# EAGLE design RobotFish (EAGLE 6.5.0)
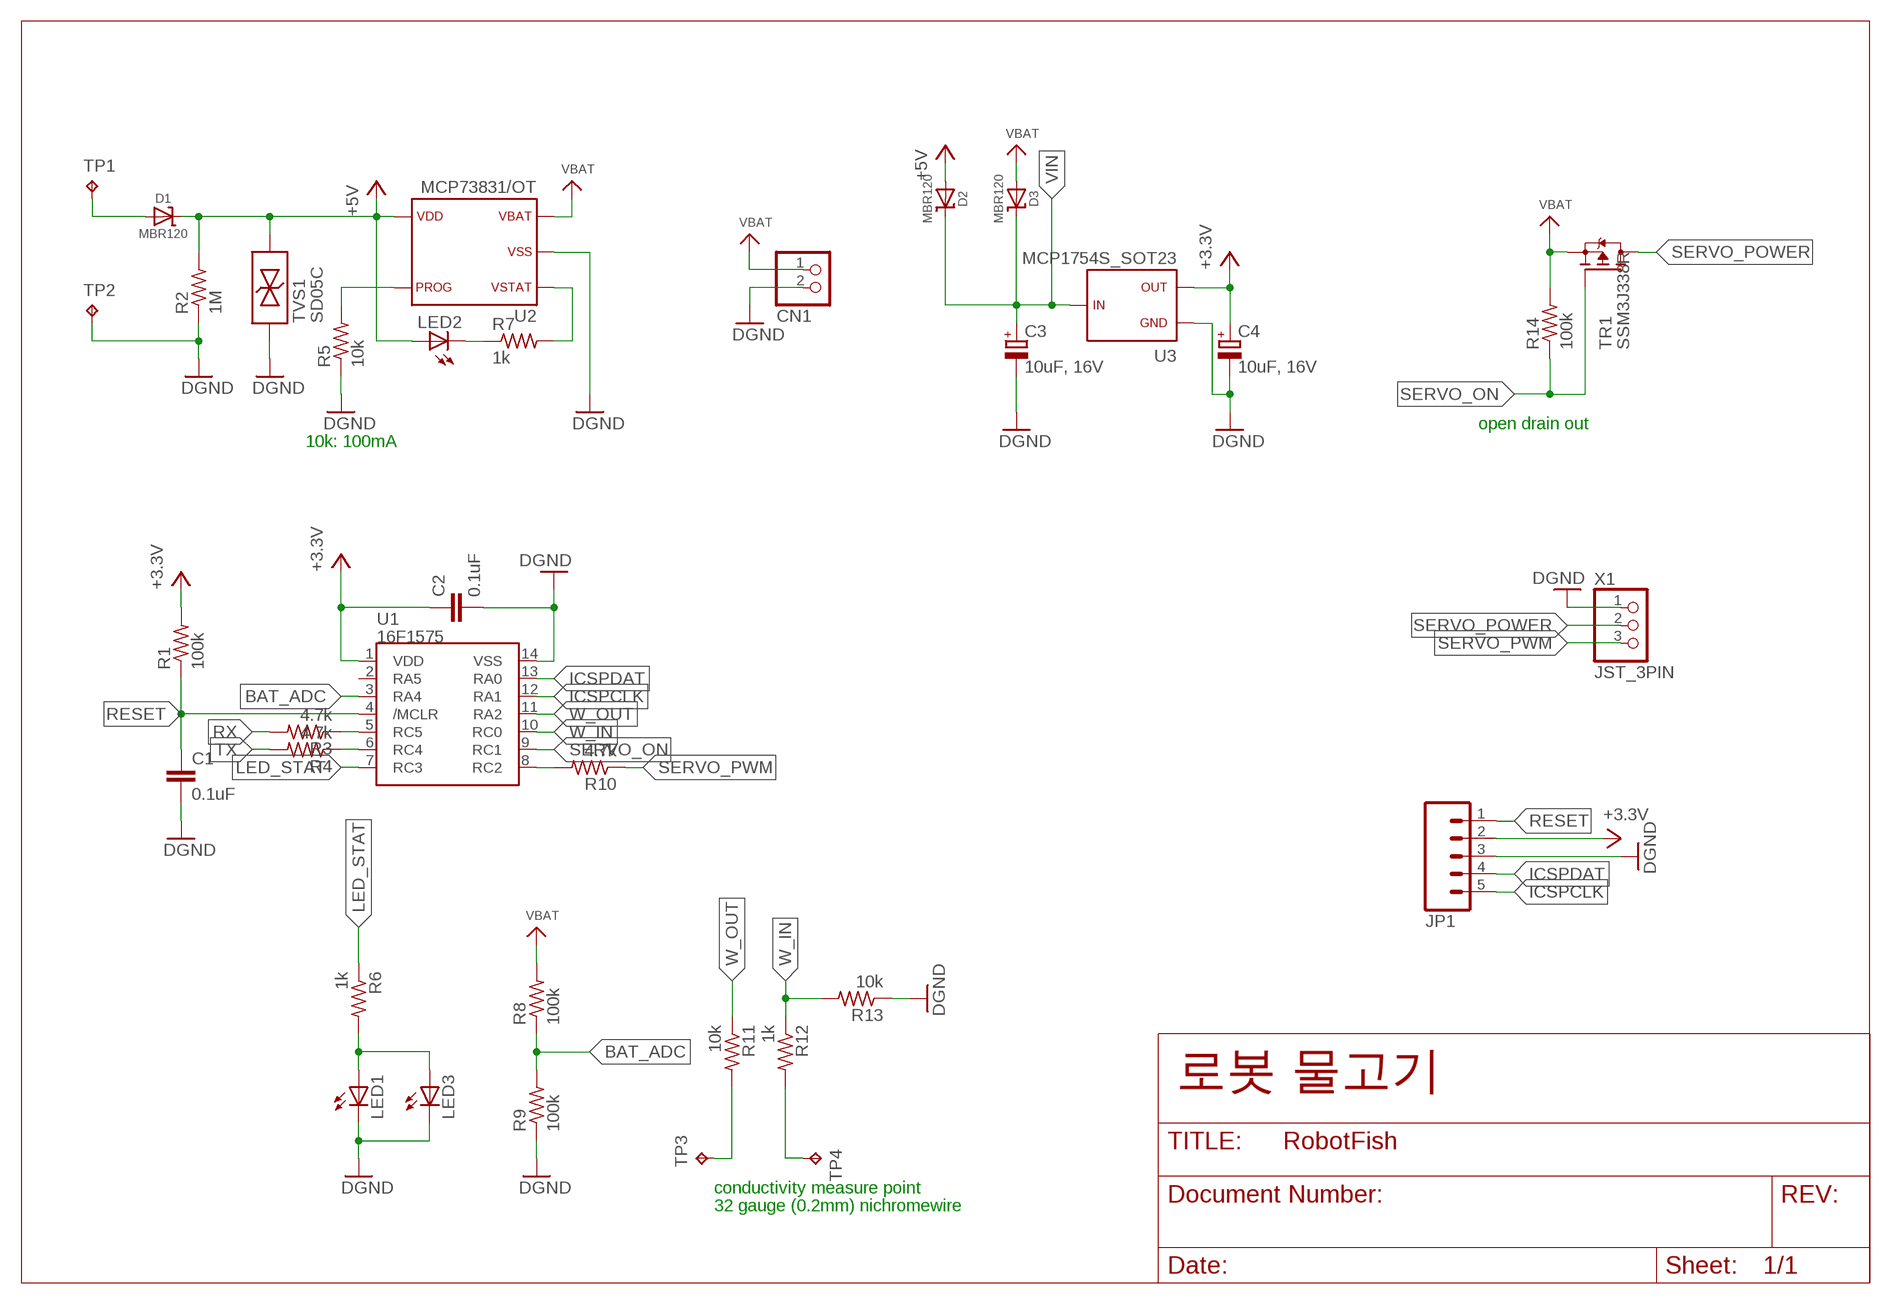
[diagram p0: schematic, sheet 1]

## Parts
C1  0.1uF  C0603(1608)  [C0603(1608)]
C2  0.1uF  C0603(1608)  [C0603(1608)]
C3  10uF, 16V  C-TANTAL-A  [C1206(3216)-A]
C4  10uF, 16V  C-TANTAL-A  [C1206(3216)-A]
CN1  JST_2PIN-THM-RA  [JST-PH-2-THM-RA]
D1  MBR120  DIODE-SCHOTTKYSOD-123  [SOD-123]
D2  MBR120  DIODE-SCHOTTKYSOD-123  [SOD-123]
D3  MBR120  DIODE-SCHOTTKYSOD-123  [SOD-123]
JP1  M05PTH  [1X05]
LED1  LED0603  [LED-0603]
LED2  LED0603  [LED-0603]
LED3  LED3MM  [LED3MM]
R1  100k  R0603(1608)  [R0603(1608)]
R2  1M  R0603(1608)  [R0603(1608)]
R3  4.7k  R0603(1608)  [R0603(1608)]
R4  4.7k  R0603(1608)  [R0603(1608)]
R5  10k  R0603(1608)  [R0603(1608)]
R6  1k  R0603(1608)  [R0603(1608)]
R7  1k  R0603(1608)  [R0603(1608)]
R8  100k  R0603(1608)  [R0603(1608)]
R9  100k  R0603(1608)  [R0603(1608)]
R10  4.7k  R0603(1608)  [R0603(1608)]
R11  10k  R0603(1608)  [R0603(1608)]
R12  1k  R0603(1608)  [R0603(1608)]
R13  10k  R0603(1608)  [R0603(1608)]
R14  100k  R0603(1608)  [R0603(1608)]
TP1  TP-5010  [TP-5010]
TP2  TP-5010  [TP-5010]
TP3  TP-5010  [TP-5010]
TP4  TP-5010  [TP-5010]
TR1  SSM3J338R  [SOT23]
TVS1  SD05C  SD0  [SOD-323-NOPOL]
U1  16F1575  [SO-14]
U2  MCP73831/OT  [SOT23-5L]
U3  MCP1754S_SOT23  [SOT23]
X1  JST_3PIN  [SM03B-SRSS-TB]

## Nets
+3.3V: C2.1 C4.1(+) JP1.2 R1.2 U1.1(VDD) U3.2
+5V: D1.C D2.A LED2.A R2.2 TVS1.2 U2.4(VDD)
BAT_ADC: R8.1 R9.2 U1.3(RA4)
DGND: C1.2 C2.2 C3.2(-) C4.2(-) CN1.2 JP1.3 LED1.C LED3.K(C) R2.1 R5.1 R9.1 R13.1 TP2.TP TVS1.1 U1.14(VSS) U2.2(VSS) U3.1 X1.1
ICSPCLK: JP1.5 U1.12(RA1)
ICSPDAT: JP1.4 U1.13(RA0)
LED_STAT: R6.1 U1.7(RC3)
N$1: R5.2 U2.5(PROG)
N$2: R7.2 U2.1(STAT)
N$3: LED2.C R7.1
N$4: R10.2 U1.8(RC2)
N$5: D1.A TP1.TP
N$6: R3.1 U1.5(RC5)
N$7: R4.1 U1.6(RC4)
N$8: LED1.A LED3.A R6.2
N$15: R11.2 TP3.TP
N$16: R12.2 TP4.TP
RESET: C1.1 JP1.1 R1.1 U1.4(/MCLR)
RX: R3.2
SERVO_ON: R14.1 TR1.1(G) U1.9(RC1)
SERVO_POWER: TR1.3(D) X1.2
SERVO_PWM: R10.1 X1.3
TX: R4.2
VBAT: CN1.1 D3.A R8.2 R14.2 TR1.2(S) U2.3(VBAT)
VIN: C3.1(+) D2.C D3.C U3.3
W_IN: R12.1 R13.2 U1.10(RC0)
W_OUT: R11.1 U1.11(RA2)
Unconnected: U1.2(RA5)

## Notes on the sheet
- open drain out
- 10k: 100mA
- 로봇 물고기
- conductivity measure point
- 32 gauge (0.2mm) nichromewire

## Library data of the parts
C1 C2 = water:C
C3 C4 = berry:C-TANTAL-A: TAJA105M020RNJ Tantal Capacitor Manufacturer: AVX 1206(3126) Ref: www.avx.com/docs/techinfo/tantappl.pdf
CN1 = water:JST_2PIN: JST 2-Pin Connectors of various flavors SMT-RA (S2B-PH-SM4) 4UConnector #17311 SMT (B2B-PH-SM4) THM-RA (S2B-PH) THM (B2B-PH)
D1-D3 = microbuilder:DIODE-SCHOTTKY
JP1 = SparkFun-Connectors:M05: Header 5 Standard 5-pin 0.1" header. Use with straight break away headers (SKU : PRT-00116), right angle break away headers (PRT-00553), swiss pins (PRT-00743), machine pins (PRT-00117), and female headers (PRT-00115). Molex polarized connector foot print use with SKU : PRT-08230 with associated crimp pins and housings.
LED1-LED3 = berry:LED: LEDs Standard schematic elements and footprints for 5mm, 3mm, 1206, and 0603 sized LEDs. 5mm - Spark Fun Electronics SKU : COM-00529 (and others)
R1-R14 = water:R
TP1-TP4 = water:TP
TR1 = water:SSM3J338R
TVS1 = berry:SD0: semtech TVS diode SD05C - 5V version SD12C - 12V version
U1 = water:16F1575
U2 = water:MCP73831: MCP73831/2 Miniature Single-Cell, Fully Integrated Li-Ion, Li-Polymer Charge Management Controllers. Nice and small simple lipoly charge controller, with adjustable current and status output (LED) http://www.ladyada.net/library/pcb/eaglelibrary.html
U3 = berry:MCP1754S: MCP1754s high PSRR LDO from Microchips
X1 = water:JST_3PIN

## Board
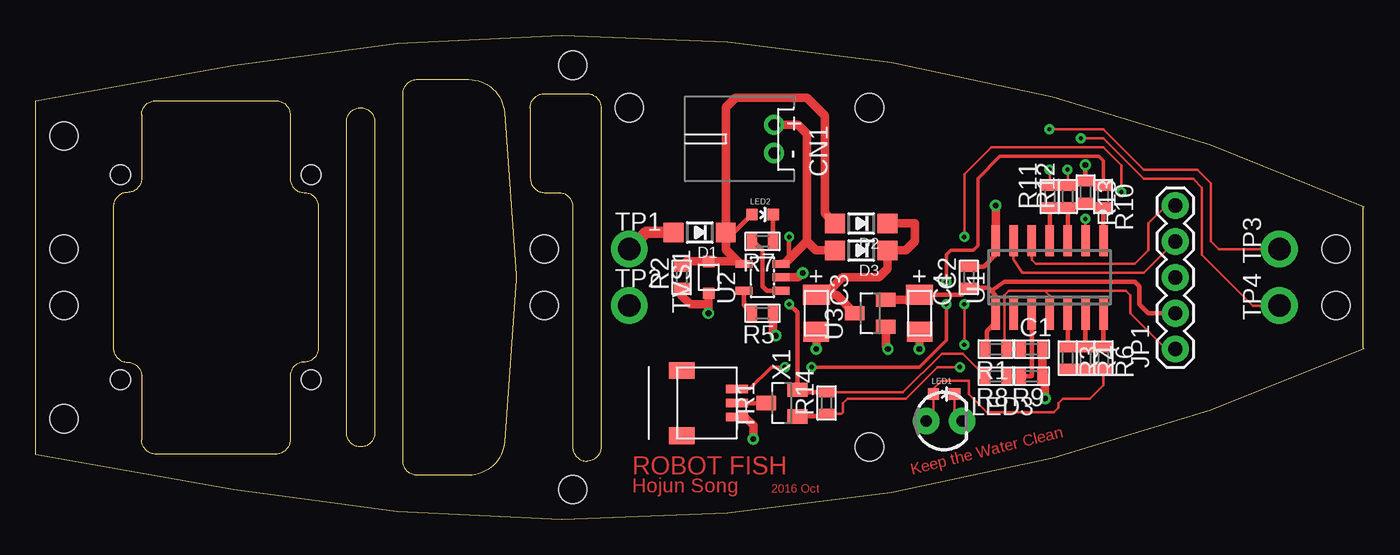
[diagram p1: board, top side]
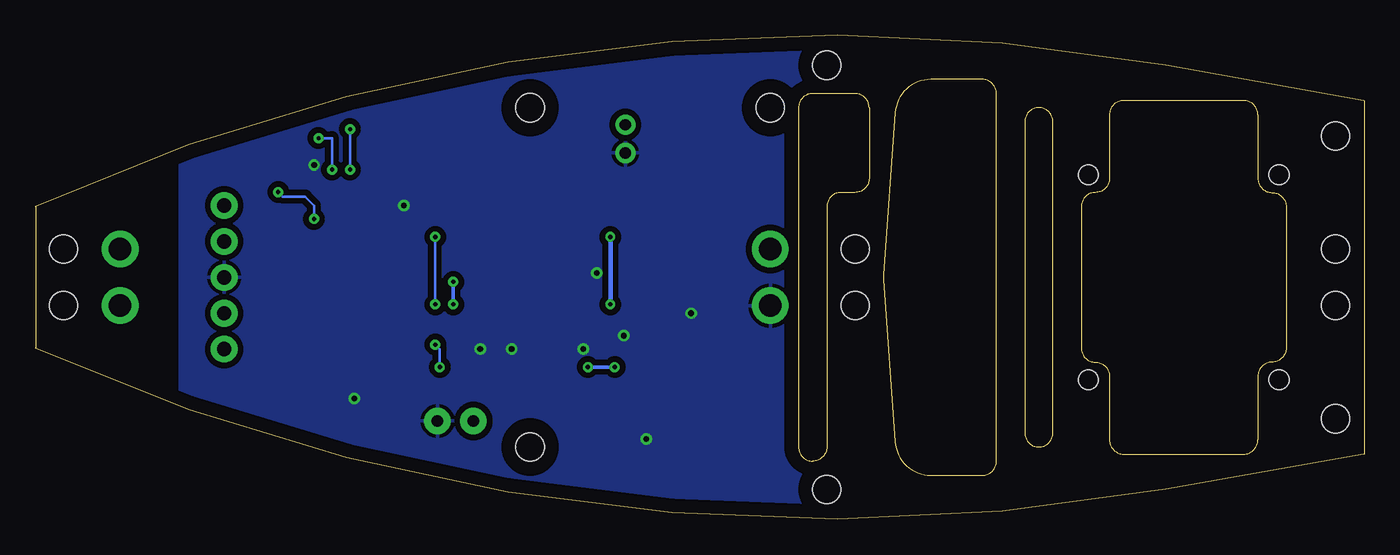
[diagram p2: board, bottom side, seen from below]

Size 94.02 x 34.23 mm. Coordinates in mm from the lower left corner, seen from the top.
Outline: 93.96,12.12 93.96,22.12
Outline: 0,29.62 0,4.62
Outline: 0.02,29.62 14.02,32.12 arc-34 94.02,22.12
Outline: 0.02,4.62 14.02,2.12 arc34 94.02,12.12
Outline: 38.02,22.12 38.02,5.12 arc90 39.02,4.12 arc90 40.02,5.12 40.02,29.12 arc90 39.02,30.12 36.02,30.12 arc90 35.02,29.12 35.02,24.12 arc90 36.02,23.12 37.02,23.12 arc-90 38.02,22.12
Outline: 7.52,28.62 7.52,24.12 arc-90 6.52,23.12 arc90 5.52,22.12 5.52,12.12 arc90 6.52,11.12 arc-90 7.52,10.12 7.52,5.62 arc90 8.52,4.62 17.02,4.62 arc90 18.02,5.62 18.02,10.12 arc-90 19.02,11.12 arc90 20.02,12.12 20.02,22.12 arc90 19.02,23.12 arc-90 18.02,24.12 18.02,28.62 arc90 17.02,29.62 8.52,29.62 arc90 7.52,28.62
Outline: 33.19,28.76 34.01,17.3 arc-8 34.01,16.93 33.19,5.47 arc-86 30.66,3.12 27.02,3.12 arc-90 26.02,4.12 26.02,30.12 arc-90 27.02,31.12 30.66,31.12 arc-86 33.19,28.76
Outline: 23.02,5.12 arc-90 22.02,6.12 22.02,28.12 arc-90 23.02,29.12 arc-90 24.02,28.12 24.02,6.12 arc-90 23.02,5.12
Copper layers (1*16): Top 0.035mm / dielectric 1.5mm / Bottom 0.035mm
Design rules "default": minimum track width 10mil, minimum drill 24mil, track to track 8mil, track to pad 8mil, pad to pad 8mil, via to via 8mil, smd to smd 8mil, copper to edge 40mil, drill to drill 8mil, minimum pad ring 10mil, minimum via ring 8mil, stop-mask expansion 4mil, vias tented up to drill 0mil, thermal gap 10mil
Holes 1.4 mm at 6.02,24.37 19.52,24.37 6.02,9.87 19.52,9.87
Holes 2 mm at 2.02,19.12 2.02,15.12 92.02,19.12 92.02,15.12 38.02,32.12 38.02,2.12 2.02,27.12 2.02,7.12 59.02,29.12 59.02,5.12 36.02,19.12 36.02,15.12 42.02,29.12

### Footprints (pad centres in the part's own frame; a part is rotated, then mirrored left to right if it is on the bottom)
C0603(1608) = smd 0.7 x 1.1: 1 -0.75,0; 2 0.75,0
C1206(3216)-A = smd 1.4 x 1.9: 1 -1.3,0 | smd 1.4 x 1.8: 2 1.3,0
JST-PH-2-THM-RA = drill 0.8 pad 1.422: 1 1,0; 2 -1,0
SOD-123 = smd 1.4 x 1.4: A 1.85,0; C -1.85,0
1X05 = drill 1.016 pad 1.88: 1 0,0; 2 2.54,0; 3 5.08,0; 4 7.62,0; 5 10.16,0
LED-0603 = smd 0.8 x 0.8: A 0,-0.75; C 0,0.75
LED3MM = drill 0.813 pad 1.88: A -1.27,0; K 1.27,0
R0603(1608) = smd 0.7 x 1.1: 1 -0.75,0; 2 0.75,0
TP-5010 = drill 1.6 pad 2.6: TP 0,0
SOT23 = smd 1 x 1.4: 1 -0.95,-1.1; 2 0.95,-1.1; 3 0,1.1
SOD-323-NOPOL = smd 0.8 x 0.8: 1 -1.125,0; 2 1.125,0
SO-14 = smd 0.6 x 2.2: 1 -3.81,-2.6; 2 -2.54,-2.6; 3 -1.27,-2.6; 4 0,-2.6; 5 1.27,-2.6; 6 2.54,-2.6; 7 3.81,-2.6; 8 3.81,2.6; 9 2.54,2.6; 10 1.27,2.6; 11 0,2.6; 12 -1.27,2.6; 13 -2.54,2.6; 14 -3.81,2.6
SOT23-5L = smd 0.55 x 1.2: 1 -0.95,-1.3; 2 0,-1.3; 3 0.95,-1.3; 4 0.95,1.3; 5 -0.95,1.3
SM03B-SRSS-TB = smd 0.6 x 1.55: 1 1,0; 2 0,0; 3 -1,0 | smd 1.2 x 1.8: P$1 2.3,-3.895; P$2 -2.3,-3.895

### Placement (x,y rotation side)
C1  70.5,12.04 0 top
C2  66.06,17.12 90 top
C3  55.26,14.58 270 top
C4  62.56,14.58 270 top
CN1  52.28,26.91 90 top
D1  47.01,20.29 180 top
D2  58.44,20.93 180 top
D3  58.44,19.02 180 top
JP1  80.66,12.04 90 top
LED1  64.29,8.86 270 top
LED2  51.45,21.56 270 top
LED3  64.29,6.96 0 top
R1  67.96,12.04 180 top
R2  45.73,17.12 90 top
R3  73.04,11.4 270 top
R4  74.31,11.4 270 top
R5  51.45,14.58 180 top
R6  75.58,11.4 270 top
R7  51.45,19.66 180 top
R8  67.96,10.13 180 top
R9  70.5,10.13 180 top
R10  75.55,22.83 270 top
R11  71.77,22.83 90 top
R12  73.04,22.83 90 top
R13  74.31,23.15 270 top
R14  55.99,8.23 90 top
TP1  42.02,19.12 0 top
TP2  42.02,15.12 0 top
TP3  88.02,19.12 90 top
TP4  88.02,15.12 90 top
TR1  52.82,8.23 90 top
TVS1  47.64,17.12 90 top
U1  71.77,17.12 0 top
U2  51.45,17.12 90 top
U3  59.07,14.58 90 top
X1  49.64,8.23 270 top

### Tracks (layer width: path | path; a pad name or v marks a point on that pad's centre or on a via)
+3.3V
  Top 0.305: 67.63,16.16 67.43,16.37 C2.1 65.56,15.88 C4.1 | 67.63,16.16 67.94,15.85 67.94,14.53 U1.1 67.96,13.96 67.31,13.31 67.31,12.14 R1.2 | JP1.2 78.74,14.58 78.11,15.21 78.11,16.48 77.79,16.8 68.58,16.8 67.63,16.16
  Top 0.61: U3.2 62.53,15.53 C4.1
+5V
  Top 0.305: D1.C 49.43,20.29 LED2.A
  Top 0.61: D2.A 55.88,21.63 55.88,28.55 54.61,29.82 49.53,29.82 48.86,29.14 D1.C 48.86,19.06 49.53,18.39 | 49.53,18.39 49.85,18.07 U2.4 | 49.53,18.39 49.39,18.24 TVS1.2 46.11,18.24 R2.2
BAT_ADC
  Top 0.305: U1.3 70.5,10.15 70.49,10.13 R9.2 R8.1
DGND  (via drill 0.4)
  Top 0.16: LED1.C 65.04,7.48 LED3.K
  Top 0.305: C2.2 67.11,17.87 67.94,18.7 67.94,19.7 U1.14 | R13.1 74.31,24.72 v74.3,25.05
  Top 0.61: U2.2 53.98,17.12 v54.29,17.43 | C3.2 55.26,12.37 v55.25,12.04 | U3.1 60.17,12.19 v60.33,12.04 | C4.2 62.56,12.05 v62.55,12.04 | TVS1.1 47.64,15.21 | 47.64,15.21 47.64,14.59 v47.62,14.58 | R2.1 45.73,15.83 46.36,15.21 47.64,15.21 | R5.1 52.2,13.18 v52.39,12.99 | U1.14 67.96,22.18 v67.94,22.2 | X1.1 50.21,7.23 50.8,6.64 v50.8,5.69 | C1.2 R9.1 71.44,10.13 v71.44,8.54
  pour Bottom (isolate 0.406): 0,29.82 30.48,34.9 66.04,33.63 83.82,26.01 83.82,8.23 67.31,0.61 30.48,-0.66 0,4.42
ICSPCLK
  Top 0.16: JP1.5 80.01,22.2 78.74,20.93 78.74,19.02 77.79,18.07 70.8,18.07 70.5,18.37 U1.12
ICSPDAT
  Top 0.16: JP1.4 80.65,19.66 78.42,17.43 69.85,17.43 69.22,18.39 69.22,19.7 U1.13
LED_STAT
  Top 0.305: R6.1 U1.7
N$1
  Top 0.305: U2.5 50.15,15.13 R5.2
N$2
  Top 0.305: R7.2 50.8,19.66 51.44,19.02 51.44,16.48 51.75,16.17 U2.1
N$3
  Top 0.305: LED2.C R7.1
N$4
  Top 0.305: U1.8 75.58,22.05 R10.2
N$5
  Top 0.813: D1.A 43.2,20.29 TP1.TP
N$6
  Top 0.305: U1.5 R3.1
N$7
  Top 0.305: U1.6 R4.1
N$8
  Top 0.16: LED3.A 63.54,7.16 LED1.A 63.54,9.22 64.14,9.81 66.04,9.81 66.04,8.86 67.31,7.59 72.07,7.59 72.39,7.91 72.39,8.23 72.71,8.54 74.61,8.54 75.56,9.5 75.56,10.64 R6.2
N$15  (via drill 0.3)
  Top 0.16: R11.2 71.77,24.72 v71.75,24.74 | TP3.TP 83.72,19.12 83.19,19.66 83.19,23.78 82.23,24.74 78.42,24.74 75.56,27.59 v71.75,27.59
  Bottom 0.16: v71.75,24.74 v71.75,27.59
N$16  (via drill 0.3)
  Top 0.16: R12.2 73.04,24.72 v73.03,24.74 | TP4.TP 86.14,15.12 82.55,18.7 82.55,23.47 81.92,24.1 78.42,24.1 75.56,26.96 v73.98,26.96
  Bottom 0.16: v73.03,24.74 73.03,26.96 v73.98,26.96
RESET
  Top 0.16: U1.4 71.77,15.83 71.44,16.16 | 71.44,16.16 68.9,16.16 68.58,15.85 68.58,12.17 R1.1 | JP1.1 80.01,12.04 77.47,14.58 77.47,15.85 77.15,16.16 71.44,16.16
  Top 0.305: R1.1 C1.1
SERVO_ON  (via drill 0.3)
  Top 0.16: R14.1 57.04,7.48 57.15,7.59 57.15,8.23 57.47,8.54 61.59,8.54 63.82,10.77 v65.41,10.77 | v65.72,12.35 v65.72,15.21 | v65.72,19.97 65.72,24.42 67.63,26.32 75.56,26.32 76.84,25.05 v76.84,23.15 | U1.9 74.31,21.23 v74.3,21.24
  Top 0.305: TR1.1 55.79,7.28 R14.1
  Bottom 0.16: v65.41,10.77 65.41,12.04 v65.72,12.35 | v65.72,15.21 v65.72,19.97 | v74.3,21.24 74.3,22.2 74.93,22.83 76.52,22.83 v76.84,23.15
SERVO_POWER
  Top 0.305: TR1.3 X1.2
SERVO_PWM  (via drill 0.3)
  Top 0.254: X1.3 50.53,9.23 52.07,10.77 v53.02,10.77 | v54.93,10.77 62.55,10.77 64.45,12.67 v64.45,15.21 | v64.45,16.8 64.45,18.7 64.77,19.02 66.36,19.02 66.68,19.34 66.68,24.1 68.26,25.69 75.25,25.69 75.56,25.37 75.56,23.6 R10.1
  Bottom 0.254: v53.02,10.77 v54.93,10.77 | v64.45,15.21 v64.45,16.8
VBAT  (via drill 0.3)
  Top 0.16: R14.2 61.39,8.98 64.14,11.72 65.62,11.72 R8.2
  Top 0.305: R14.2 54.12,8.98 TR1.2 53.92,14.64 v53.34,15.21 | v53.34,19.97 53.34,18.39
  Top 0.61: CN1.1 53.98,27.91 54.61,27.28 54.61,19.66 | 54.61,19.66 53.34,18.39 53.02,18.07 U2.3 | D3.A 55.25,19.02 54.61,19.66
  Bottom 0.305: v53.34,15.21 v53.34,19.97
VIN
  Top 0.61: D2.C 62.23,20.93 62.23,19.66 61.59,19.02 D3.C 60.29,17.71 59.69,17.12 57.12,17.12 55.88,15.88 | C3.1 55.88,15.88 | 55.88,15.88 56.67,15.88 U3.3
W_IN
  Top 0.305: U1.10 R12.1 R13.2
W_OUT
  Top 0.305: U1.11 R11.1

### Text on the board
Top: ROBOT FISH | Keep the Water Clean | Hojun Song | 2016 Oct
tStop: ROBOT FISH | Keep the Water Clean | Hojun Song | 2016 Oct